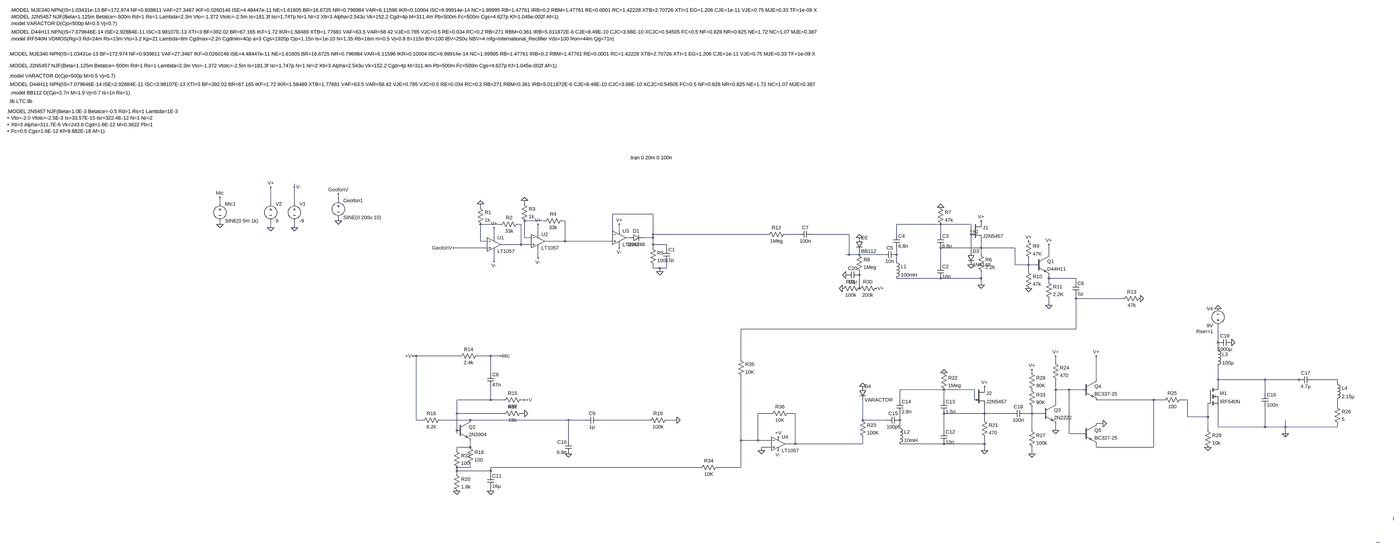
[diagram p0: schematic Final.asc, whole sheet]
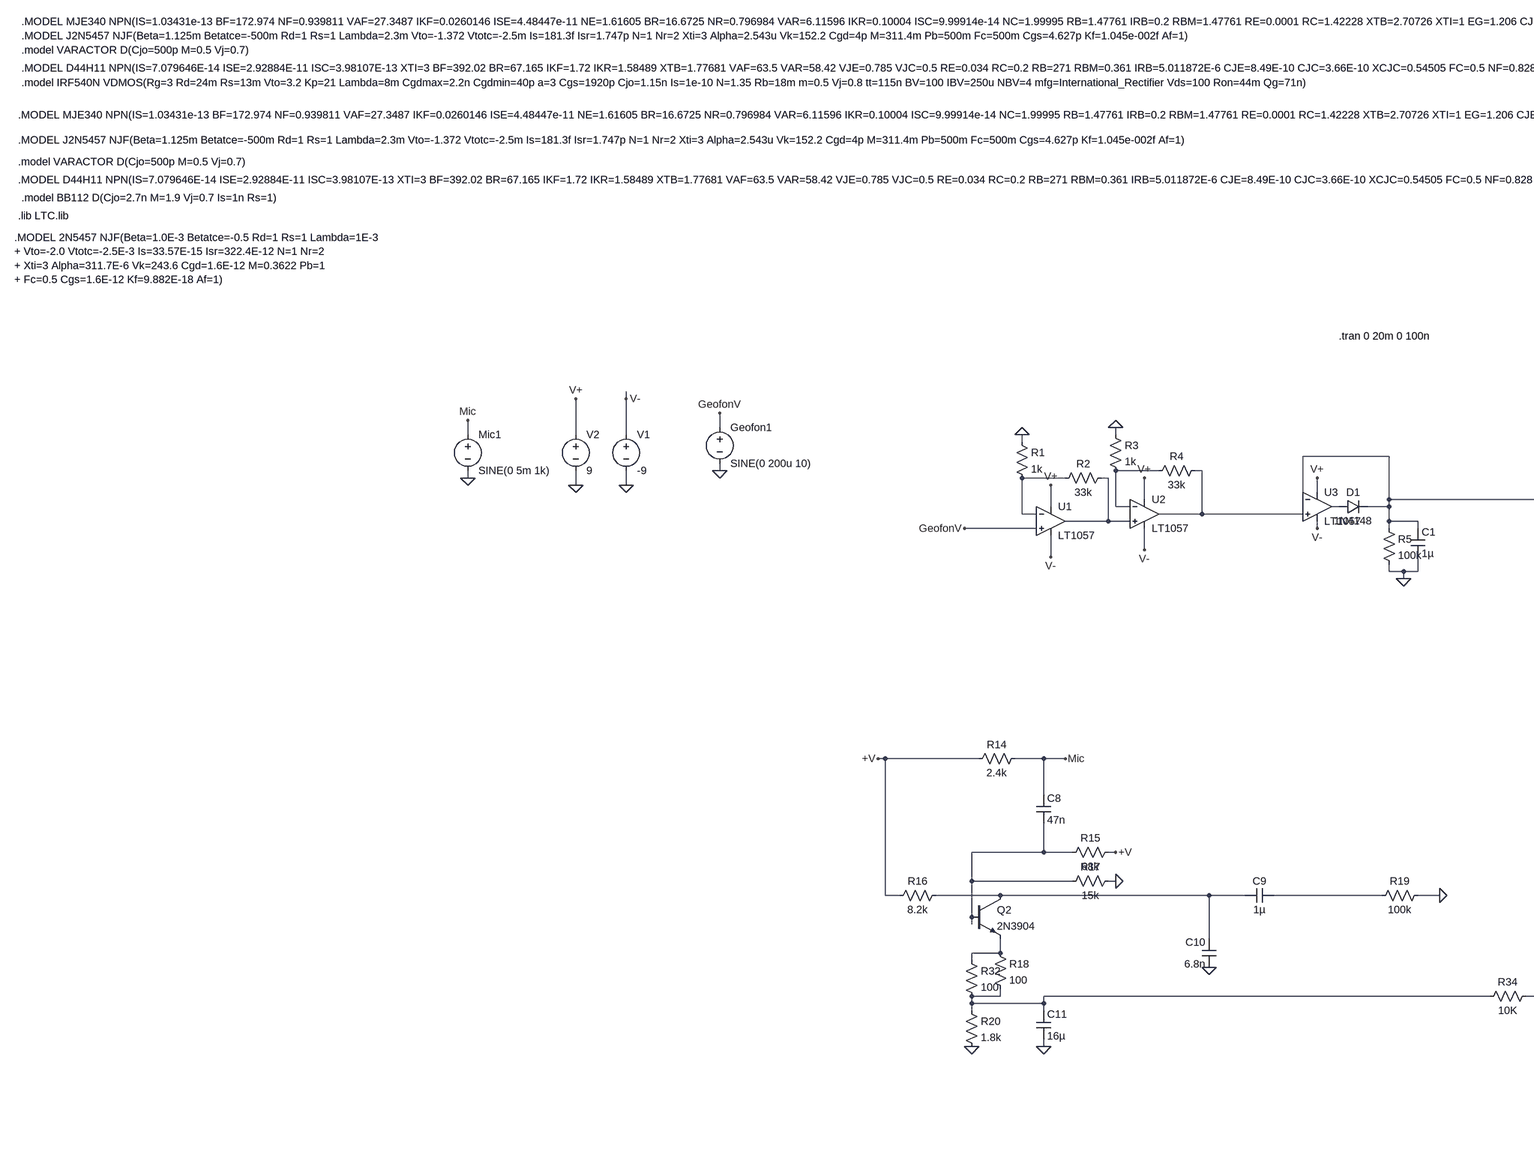
[diagram p1: schematic Final.asc, part, row 1 of 1, column 1 of 2]
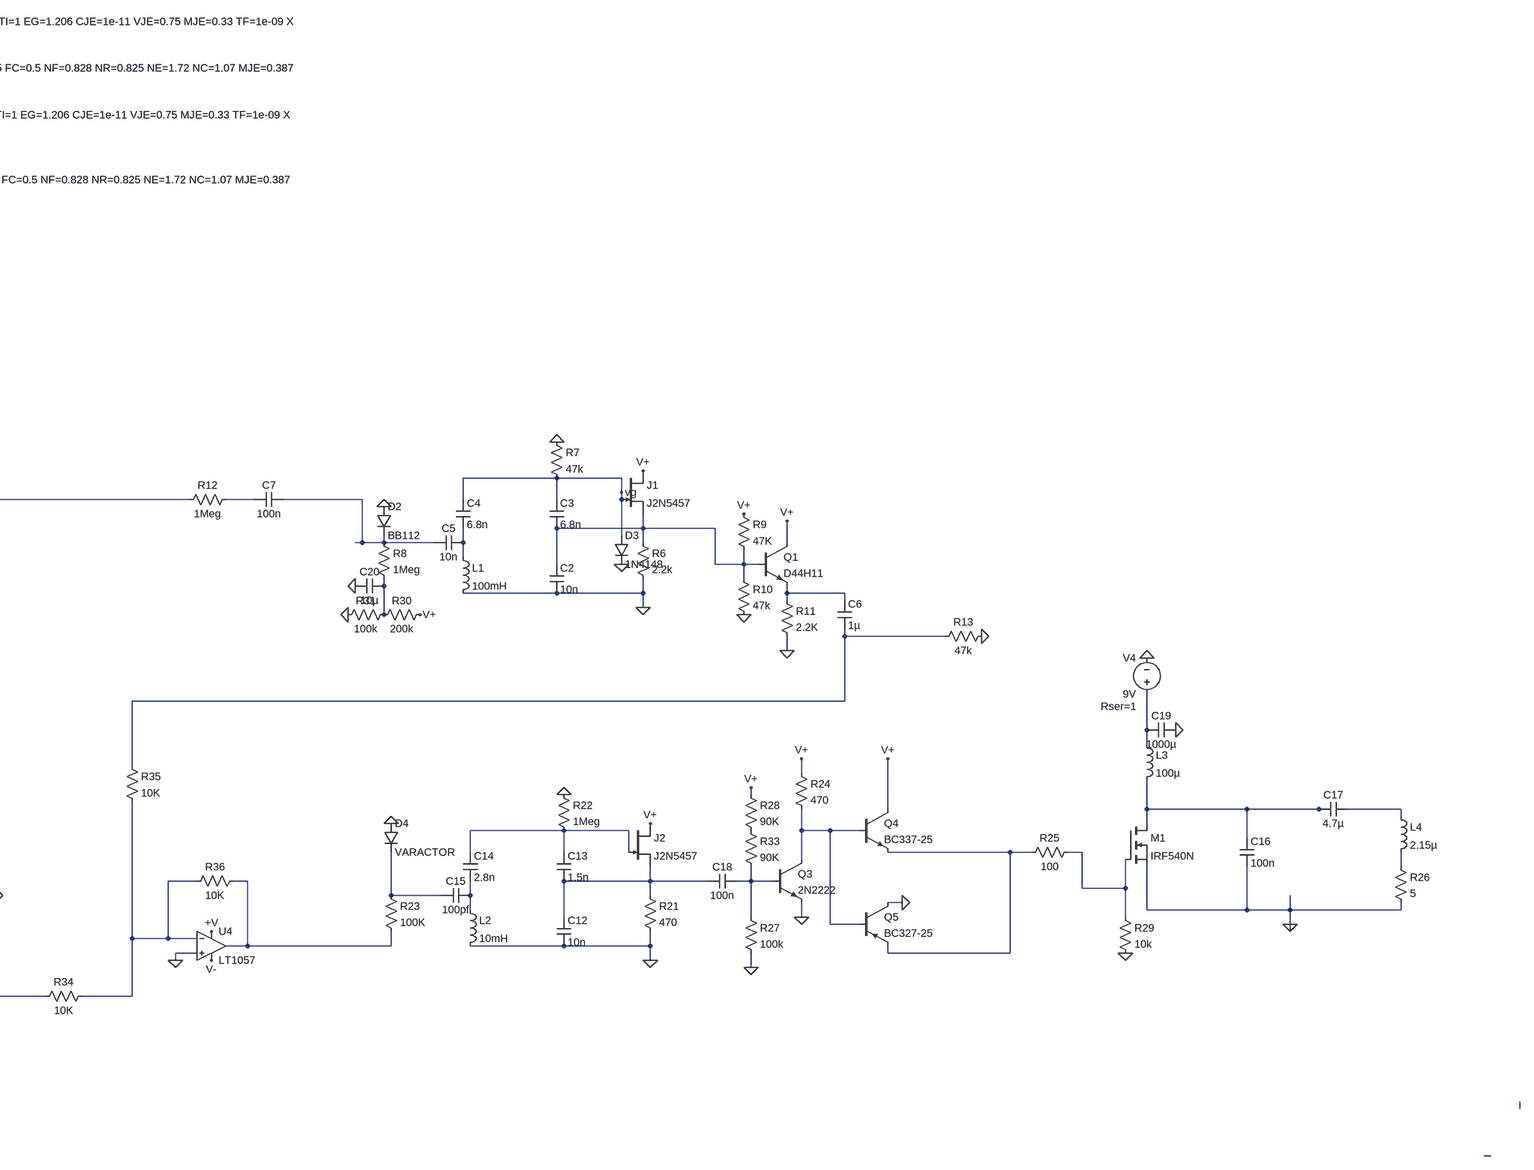
[diagram p2: schematic Final.asc, part, row 1 of 1, column 2 of 2]
Final.asc, the LTspice schematic file:
Version 4.1
SHEET 1 12308 6308
WIRE -4208 1680 -4208 1664
WIRE -4000 1744 -4000 1712
WIRE -4560 1760 -4560 1728
WIRE -4320 1760 -4320 1680
WIRE -4208 1760 -4208 1680
WIRE -3120 1760 -3120 1744
WIRE -3328 1776 -3328 1760
WIRE -2512 1808 -2704 1808
WIRE -4000 1840 -4000 1824
WIRE -3024 1840 -3120 1840
WIRE -2928 1840 -2944 1840
WIRE -4560 1856 -4560 1840
WIRE -3232 1856 -3328 1856
WIRE -3136 1856 -3152 1856
WIRE -1104 1856 -1312 1856
WIRE -960 1856 -1104 1856
WIRE -4320 1872 -4320 1840
WIRE -4208 1872 -4208 1840
WIRE -2672 1888 -2672 1856
WIRE -960 1888 -960 1856
WIRE -3056 1904 -3056 1856
WIRE -2704 1904 -2704 1808
WIRE -2512 1904 -2512 1808
WIRE -1968 1904 -2512 1904
WIRE -1824 1904 -1888 1904
WIRE -1536 1904 -1760 1904
WIRE -1312 1904 -1312 1856
WIRE -1104 1904 -1104 1856
WIRE -960 1904 -960 1888
WIRE -3264 1920 -3264 1872
WIRE -3120 1920 -3120 1840
WIRE -3088 1920 -3120 1920
WIRE -2624 1920 -2640 1920
WIRE -2512 1920 -2512 1904
WIRE -2512 1920 -2560 1920
WIRE -3328 1936 -3328 1856
WIRE -3296 1936 -3328 1936
WIRE -2928 1936 -2928 1840
WIRE -2928 1936 -3024 1936
WIRE -2704 1936 -2928 1936
WIRE -3136 1952 -3136 1856
WIRE -3136 1952 -3232 1952
WIRE -3088 1952 -3136 1952
WIRE -2512 1952 -2512 1920
WIRE -2448 1952 -2512 1952
WIRE -3296 1968 -3456 1968
WIRE -2672 1968 -2672 1952
WIRE -2512 1968 -2512 1952
WIRE -2448 1968 -2448 1952
WIRE -912 1968 -912 1936
WIRE -912 1968 -1104 1968
WIRE -752 1968 -912 1968
WIRE -960 1984 -960 1904
WIRE -1536 2000 -1536 1904
WIRE -1536 2000 -1552 2000
WIRE -1488 2000 -1488 1984
WIRE -1488 2000 -1536 2000
WIRE -1376 2000 -1488 2000
WIRE -1312 2000 -1312 1968
WIRE -912 2000 -912 1968
WIRE -592 2000 -592 1952
WIRE -3056 2016 -3056 1968
WIRE -3264 2032 -3264 1984
WIRE -1312 2032 -1312 2000
WIRE -1104 2048 -1104 1968
WIRE -960 2048 -960 2032
WIRE -752 2048 -752 1968
WIRE -688 2048 -688 2016
WIRE -688 2048 -752 2048
WIRE -656 2048 -688 2048
WIRE -2512 2064 -2512 2048
WIRE -2480 2064 -2512 2064
WIRE -2448 2064 -2448 2032
WIRE -2448 2064 -2480 2064
WIRE -2480 2080 -2480 2064
WIRE -688 2080 -688 2048
WIRE -1488 2096 -1488 2080
WIRE -1104 2112 -1312 2112
WIRE -912 2112 -912 2080
WIRE -912 2112 -1104 2112
WIRE -592 2112 -592 2096
WIRE -464 2112 -592 2112
WIRE -592 2128 -592 2112
WIRE -464 2128 -464 2112
WIRE -912 2144 -912 2112
WIRE -1488 2160 -1488 2096
WIRE -464 2208 -464 2192
WIRE -240 2208 -464 2208
WIRE -592 2240 -592 2208
WIRE -464 2352 -464 2208
WIRE -464 2352 -2096 2352
WIRE 208 2416 208 2336
WIRE 208 2448 208 2416
WIRE -3632 2480 -3648 2480
WIRE -3424 2480 -3632 2480
WIRE -3280 2480 -3344 2480
WIRE -3232 2480 -3280 2480
WIRE -2096 2496 -2096 2352
WIRE -560 2512 -560 2480
WIRE -3280 2560 -3280 2480
WIRE -672 2560 -672 2544
WIRE -368 2592 -368 2480
WIRE 208 2592 208 2528
WIRE 432 2592 208 2592
WIRE 592 2592 432 2592
WIRE 608 2592 592 2592
WIRE 816 2592 656 2592
WIRE 816 2608 816 2592
WIRE 208 2624 208 2592
WIRE -1088 2640 -1296 2640
WIRE -944 2640 -1088 2640
WIRE -560 2640 -560 2592
WIRE -496 2640 -560 2640
WIRE -432 2640 -496 2640
WIRE 432 2656 432 2592
WIRE -3280 2688 -3280 2624
WIRE -3280 2688 -3440 2688
WIRE -3216 2688 -3280 2688
WIRE -3120 2688 -3136 2688
WIRE -1296 2688 -1296 2640
WIRE -1088 2688 -1088 2640
WIRE -944 2688 -944 2640
WIRE -96 2688 -368 2688
WIRE -48 2688 -96 2688
WIRE 64 2688 32 2688
WIRE -560 2704 -560 2640
WIRE 816 2720 816 2688
WIRE -3440 2752 -3440 2688
WIRE -3216 2752 -3440 2752
WIRE -3120 2752 -3136 2752
WIRE -1952 2752 -2016 2752
WIRE -1840 2752 -1872 2752
WIRE -896 2752 -896 2720
WIRE -896 2752 -1088 2752
WIRE -768 2752 -896 2752
WIRE -672 2752 -672 2720
WIRE -672 2752 -704 2752
WIRE -624 2752 -672 2752
WIRE 64 2768 64 2688
WIRE 160 2768 160 2704
WIRE 160 2768 64 2768
WIRE -3632 2784 -3632 2480
WIRE -3600 2784 -3632 2784
WIRE -3376 2784 -3520 2784
WIRE -2912 2784 -3376 2784
WIRE -2832 2784 -2912 2784
WIRE -2528 2784 -2768 2784
WIRE -2400 2784 -2448 2784
WIRE -1472 2784 -1472 2688
WIRE -1360 2784 -1472 2784
WIRE -1296 2784 -1296 2752
WIRE -896 2784 -896 2752
WIRE -336 2800 -368 2800
WIRE -1296 2816 -1296 2784
WIRE 208 2816 208 2720
WIRE 432 2816 432 2720
WIRE 432 2816 208 2816
WIRE 528 2816 528 2784
WIRE 528 2816 432 2816
WIRE 816 2816 816 2800
WIRE 816 2816 528 2816
WIRE -3440 2832 -3440 2752
WIRE -1088 2832 -1088 2752
WIRE -672 2832 -672 2752
WIRE -560 2832 -560 2800
WIRE 160 2832 160 2768
WIRE -3440 2848 -3440 2832
WIRE -496 2848 -496 2640
WIRE -432 2848 -496 2848
WIRE 528 2848 528 2816
WIRE 528 2864 528 2848
WIRE -2912 2880 -2912 2784
WIRE -2096 2880 -2096 2576
WIRE -2016 2880 -2016 2752
WIRE -2016 2880 -2096 2880
WIRE -1952 2880 -2016 2880
WIRE -1840 2896 -1840 2752
WIRE -1840 2896 -1888 2896
WIRE -1472 2896 -1472 2864
WIRE -1472 2896 -1840 2896
WIRE -1088 2896 -1296 2896
WIRE -896 2896 -896 2864
WIRE -896 2896 -1088 2896
WIRE -3376 2912 -3376 2880
WIRE -3376 2912 -3440 2912
WIRE -1952 2912 -2000 2912
WIRE -368 2912 -368 2896
WIRE -96 2912 -96 2688
WIRE -96 2912 -368 2912
WIRE -3440 2928 -3440 2912
WIRE -2000 2928 -2000 2912
WIRE -896 2928 -896 2896
WIRE -672 2944 -672 2912
WIRE -3376 3008 -3376 2992
WIRE -3376 3008 -3440 3008
WIRE -2288 3008 -3280 3008
WIRE -2096 3008 -2096 2880
WIRE -2096 3008 -2208 3008
WIRE -3440 3024 -3440 3008
WIRE -3280 3024 -3280 3008
WIRE -3280 3024 -3440 3024
WIRE -3440 3040 -3440 3024
WIRE -3280 3040 -3280 3024
WIRE -3280 3120 -3280 3104
WIRE 2400 3360 2400 3344
WIRE 2336 3728 2320 3728
FLAG -4000 1712 GeofonV
FLAG -4000 1840 0
FLAG -4208 1872 0
FLAG -4320 1872 0
FLAG -4320 1680 V+
FLAG -4208 1680 V-
FLAG -3264 2032 V-
FLAG -3264 1872 V+
FLAG -3328 1760 0
FLAG -3456 1968 GeofonV
FLAG -3056 2016 V-
FLAG -3056 1856 V+
FLAG -3120 1744 0
FLAG -2480 2080 0
FLAG -2672 1968 V-
FLAG -2672 1856 V+
FLAG -912 2144 0
FLAG -1104 1776 0
FLAG -1488 1920 0
FLAG -688 2160 0
FLAG -592 2240 0
FLAG -960 1888 vg
FLAG -160 2208 0
FLAG -960 2048 0
FLAG -3232 2480 Mic
FLAG -4560 1856 0
FLAG -4560 1728 Mic
FLAG -2912 2944 0
FLAG -3120 2752 0
FLAG -2400 2784 0
FLAG -3440 3120 0
FLAG -3280 3120 0
FLAG -896 2928 0
FLAG -1088 2560 0
FLAG -1472 2624 0
FLAG 528 2848 0
FLAG -560 2832 0
FLAG -336 2800 0
FLAG -672 2944 0
FLAG 160 2912 0
FLAG -2000 2928 0
FLAG -3648 2480 +V
FLAG -3120 2688 +V
FLAG -1920 2864 +V
FLAG -912 1840 V+
FLAG -688 1936 V+
FLAG -592 1952 V+
FLAG -896 2624 V+
FLAG -672 2544 V+
FLAG -560 2480 V+
FLAG -368 2480 V+
FLAG 208 2256 0
FLAG 272 2416 0
FLAG -1920 2928 V-
FLAG -1568 2160 0
FLAG -1408 2160 V+
FLAG -1552 2096 0
SYMBOL voltage -4000 1728 R0
WINDOW 123 0 0 Left 0
WINDOW 39 0 0 Left 0
SYMATTR InstName Geofon1
SYMATTR Value SINE(0 200u 10)
SYMBOL OpAmps\\opamp2 -3264 1888 R0
SYMATTR InstName U1
SYMATTR Value LT1057
SYMBOL voltage -4208 1744 R0
SYMATTR InstName V1
SYMATTR Value -9
SYMBOL voltage -4320 1744 R0
SYMATTR InstName V2
SYMATTR Value 9
SYMBOL res -3344 1760 R0
SYMATTR InstName R1
SYMATTR Value 1k
SYMBOL res -3136 1840 R90
WINDOW 0 0 56 VBottom 2
WINDOW 3 32 56 VTop 2
SYMATTR InstName R2
SYMATTR Value 33k
SYMBOL OpAmps\\opamp2 -3056 1872 R0
SYMATTR InstName U2
SYMATTR Value LT1057
SYMBOL res -3136 1744 R0
SYMATTR InstName R3
SYMATTR Value 1k
SYMBOL res -2928 1824 R90
WINDOW 0 0 56 VBottom 2
WINDOW 3 32 56 VTop 2
SYMATTR InstName R4
SYMATTR Value 33k
SYMBOL res -2528 1952 R0
SYMATTR InstName R5
SYMATTR Value 100k
SYMBOL cap -2464 1968 R0
SYMATTR InstName C1
SYMATTR Value 1µ
SYMBOL OpAmps\\LT1057 -2672 1856 R0
SYMATTR InstName U3
SYMBOL diode -2624 1936 R270
WINDOW 0 32 32 VTop 2
WINDOW 3 0 32 VBottom 2
SYMATTR InstName D1
SYMATTR Value 1N4148
SYMBOL njf -960 1840 R0
SYMATTR InstName J1
SYMATTR Value J2N5457
SYMBOL res -928 1984 R0
SYMATTR InstName R6
SYMATTR Value 2.2k
SYMBOL cap -1120 2048 R0
SYMATTR InstName C2
SYMATTR Value 10n
SYMBOL cap -1120 1904 R0
SYMATTR InstName C3
SYMATTR Value 6.8n
SYMBOL cap -1328 1904 R0
SYMATTR InstName C4
SYMATTR Value 6.8n
SYMBOL ind -1328 2016 R0
SYMATTR InstName L1
SYMATTR Value 100mH
SYMATTR SpiceLine Rser=1m
SYMBOL res -1120 1760 R0
SYMATTR InstName R7
SYMATTR Value 47k
SYMBOL diode -1504 1920 R0
SYMATTR InstName D2
SYMATTR Value BB112
SYMBOL cap -1312 1984 R90
WINDOW 0 0 32 VBottom 2
WINDOW 3 32 32 VTop 2
SYMATTR InstName C5
SYMATTR Value 10n
SYMBOL res -1504 1984 R0
SYMATTR InstName R8
SYMATTR Value 1Meg
SYMBOL npn -656 2000 R0
SYMATTR InstName Q1
SYMATTR Value D44H11
SYMBOL res -704 1920 R0
SYMATTR InstName R9
SYMATTR Value 47K
SYMBOL res -704 2064 R0
SYMATTR InstName R10
SYMATTR Value 47k
SYMBOL res -608 2112 R0
SYMATTR InstName R11
SYMATTR Value 2.2K
SYMBOL cap -480 2128 R0
SYMATTR InstName C6
SYMATTR Value 1µ
SYMBOL res -1872 1888 R90
WINDOW 0 0 56 VBottom 2
WINDOW 3 32 56 VTop 2
SYMATTR InstName R12
SYMATTR Value 1Meg
SYMBOL res -144 2192 R90
WINDOW 0 0 56 VBottom 2
WINDOW 3 32 56 VTop 2
SYMATTR InstName R13
SYMATTR Value 47k
SYMBOL diode -976 1984 R0
SYMATTR InstName D3
SYMATTR Value 1N4148
SYMBOL cap -1760 1888 R90
WINDOW 0 0 32 VBottom 2
WINDOW 3 32 32 VTop 2
SYMATTR InstName C7
SYMATTR Value 100n
SYMBOL res -3328 2464 R90
WINDOW 0 0 56 VBottom 2
WINDOW 3 32 56 VTop 2
SYMATTR InstName R14
SYMATTR Value 2.4k
SYMBOL voltage -4560 1744 R0
WINDOW 123 0 0 Left 0
WINDOW 39 0 0 Left 0
SYMATTR InstName Mic1
SYMATTR Value SINE(0 5m 1k)
SYMBOL cap -3296 2560 R0
SYMATTR InstName C8
SYMATTR Value 47n
SYMBOL res -3120 2672 R90
WINDOW 0 0 56 VBottom 2
WINDOW 3 32 56 VTop 2
SYMATTR InstName R15
SYMATTR Value 68k
SYMBOL npn -3440 2784 R0
SYMATTR InstName Q2
SYMATTR Value 2N3904
SYMBOL res -3504 2768 R90
WINDOW 0 0 56 VBottom 2
WINDOW 3 32 56 VTop 2
SYMATTR InstName R16
SYMATTR Value 8.2k
SYMBOL res -3120 2736 R90
WINDOW 0 0 56 VBottom 2
WINDOW 3 32 56 VTop 2
SYMATTR InstName R17
SYMATTR Value 15k
SYMBOL cap -2768 2768 R90
WINDOW 0 0 32 VBottom 2
WINDOW 3 32 32 VTop 2
SYMATTR InstName C9
SYMATTR Value 1µ
SYMBOL cap -2896 2944 R180
WINDOW 0 24 56 Left 2
WINDOW 3 24 8 Left 2
SYMATTR InstName C10
SYMATTR Value 6.8n
SYMBOL res -3392 2896 R0
SYMATTR InstName R18
SYMATTR Value 100
SYMBOL res -2432 2768 R90
WINDOW 0 0 56 VBottom 2
WINDOW 3 32 56 VTop 2
SYMATTR InstName R19
SYMATTR Value 100k
SYMBOL res -3456 3024 R0
SYMATTR InstName R20
SYMATTR Value 1.8k
SYMBOL cap -3296 3040 R0
SYMATTR InstName C11
SYMATTR Value 16µ
SYMBOL njf -944 2624 R0
SYMATTR InstName J2
SYMATTR Value J2N5457
SYMBOL res -912 2768 R0
SYMATTR InstName R21
SYMATTR Value 470
SYMBOL cap -1104 2832 R0
SYMATTR InstName C12
SYMATTR Value 10n
SYMBOL cap -1104 2688 R0
SYMATTR InstName C13
SYMATTR Value 1.5n
SYMBOL cap -1312 2688 R0
SYMATTR InstName C14
SYMATTR Value 2.8n
SYMBOL ind -1312 2800 R0
SYMATTR InstName L2
SYMATTR Value 10mH
SYMATTR SpiceLine Rser=1m
SYMBOL res -1104 2544 R0
SYMATTR InstName R22
SYMATTR Value 1Meg
SYMBOL diode -1488 2624 R0
SYMATTR InstName D4
SYMATTR Value VARACTOR
SYMBOL cap -1296 2768 R90
WINDOW 0 0 32 VBottom 2
WINDOW 3 32 32 VTop 2
SYMATTR InstName C15
SYMATTR Value 100pf
SYMBOL res -1488 2768 R0
SYMATTR InstName R23
SYMATTR Value 100K
SYMBOL nmos 160 2624 R0
SYMATTR InstName M1
SYMATTR Value IRF540N
SYMBOL cap 416 2656 R0
SYMATTR InstName C16
SYMATTR Value 100n
SYMBOL cap 656 2576 R90
WINDOW 0 0 32 VBottom 2
WINDOW 3 32 32 VTop 2
SYMATTR InstName C17
SYMATTR Value 4.7µ
SYMBOL ind 192 2432 R0
SYMATTR InstName L3
SYMATTR Value 100µ
SYMATTR SpiceLine Rser=1m
SYMBOL npn -624 2704 R0
SYMATTR InstName Q3
SYMATTR Value 2N2222
SYMBOL npn -432 2592 R0
SYMATTR InstName Q4
SYMATTR Value BC337-25
SYMBOL pnp -432 2800 R0
SYMATTR InstName Q5
SYMATTR Value BC327-25
SYMBOL res -576 2496 R0
SYMATTR InstName R24
SYMATTR Value 470
SYMBOL res 48 2672 R90
WINDOW 0 0 56 VBottom 2
WINDOW 3 32 56 VTop 2
SYMATTR InstName R25
SYMATTR Value 100
SYMBOL ind 800 2592 R0
SYMATTR InstName L4
SYMATTR Value 2.15µ
SYMATTR SpiceLine Rser=1m
SYMBOL res 800 2704 R0
SYMATTR InstName R26
SYMATTR Value 5
SYMBOL cap -704 2736 R90
WINDOW 0 0 32 VBottom 2
WINDOW 3 32 32 VTop 2
SYMATTR InstName C18
SYMATTR Value 100n
SYMBOL res -688 2816 R0
SYMATTR InstName R27
SYMATTR Value 100k
SYMBOL res 144 2816 R0
SYMATTR InstName R29
SYMATTR Value 10k
SYMBOL OpAmps\\LT1057 -1920 2832 R0
SYMATTR InstName U4
SYMBOL res -2192 2992 R90
WINDOW 0 0 56 VBottom 2
WINDOW 3 32 56 VTop 2
SYMATTR InstName R34
SYMATTR Value 10K
SYMBOL res -1856 2736 R90
WINDOW 0 0 56 VBottom 2
WINDOW 3 32 56 VTop 2
SYMATTR InstName R36
SYMATTR Value 10K
SYMBOL res -2112 2480 R0
SYMATTR InstName R35
SYMATTR Value 10K
SYMBOL voltage 208 2352 R180
WINDOW 0 24 96 Left 2
WINDOW 3 24 16 Left 2
WINDOW 123 0 0 Left 0
WINDOW 39 24 -12 Left 2
SYMATTR InstName V4
SYMATTR Value 9V
SYMATTR SpiceLine Rser=1
SYMBOL cap 272 2400 R90
WINDOW 0 0 32 VBottom 2
WINDOW 3 32 32 VTop 2
SYMATTR InstName C19
SYMATTR Value 1000µ
SYMBOL res -1392 2144 R90
WINDOW 0 0 56 VBottom 2
WINDOW 3 32 56 VTop 2
SYMATTR InstName R30
SYMATTR Value 200k
SYMBOL res -1472 2144 R90
WINDOW 0 0 56 VBottom 2
WINDOW 3 32 56 VTop 2
SYMATTR InstName R31
SYMATTR Value 100k
SYMBOL cap -1488 2080 R90
WINDOW 0 0 32 VBottom 2
WINDOW 3 32 32 VTop 2
SYMATTR InstName C20
SYMATTR Value 10µ
SYMBOL res -3456 2912 R0
SYMATTR InstName R32
SYMATTR Value 100
SYMBOL res -688 2544 R0
SYMATTR InstName R28
SYMATTR Value 90K
SYMBOL res -688 2624 R0
SYMATTR InstName R33
SYMATTR Value 90K
TEXT -5560 408 Left 2 !.lib LTC.lib
TEXT -5552 368 Left 2 !.model BB112 D(Cjo=2.7n M=1.9 Vj=0.7 Is=1n Rs=1)
TEXT -5560 240 Left 2 !.MODEL J2N5457 NJF(Beta=1.125m Betatce=-500m Rd=1 Rs=1 Lambda=2.3m Vto=-1.372 Vtotc=-2.5m Is=181.3f Isr=1.747p N=1 Nr=2 Xti=3 Alpha=2.543u Vk=152.2 Cgd=4p M=311.4m Pb=500m Fc=500m Cgs=4.627p Kf=1.045e-002f Af=1)
TEXT -5560 288 Left 2 !.model VARACTOR D(Cjo=500p M=0.5 Vj=0.7)
TEXT -5560 328 Left 2 !.MODEL D44H11 NPN(IS=7.079646E-14 ISE=2.92884E-11 ISC=3.98107E-13 XTI=3 BF=392.02 BR=67.165 IKF=1.72 IKR=1.58489 XTB=1.77681 VAF=63.5 VAR=58.42 VJE=0.785 VJC=0.5 RE=0.034 RC=0.2 RB=271 RBM=0.361 IRB=5.011872E-6 CJE=8.49E-10 CJC=3.66E-10 XCJC=0.54505 FC=0.5 NF=0.828 NR=0.825 NE=1.72 NC=1.07 MJE=0.387 MJC=0.352 EG=0.958 VCEO=80 ICRATING=10 MFG=FAIRCHILD)
TEXT -5560 184 Left 2 !.MODEL MJE340 NPN(IS=1.03431e-13 BF=172.974 NF=0.939811 VAF=27.3487 IKF=0.0260146 ISE=4.48447e-11 NE=1.61605 BR=16.6725 NR=0.796984 VAR=6.11596 IKR=0.10004 ISC=9.99914e-14 NC=1.99995 RB=1.47761 IRB=0.2 RBM=1.47761 RE=0.0001 RC=1.42228 XTB=2.70726 XTI=1 EG=1.206 CJE=1e-11 VJE=0.75 MJE=0.33 TF=1e-09 XTF=1 VTF=10 ITF=0.01 CJC=1e-11 VJC=0.75 MJC=0.33 XCJC=0.9 FC=0.5 CJS=0 VJS=0.75 MJS=0.5 TR=1e-07 PTF=0 Vceo=300 Icrating=0.5A mfg=OnSemi)
TEXT -5568 456 Left 2 !.MODEL 2N5457 NJF(Beta=1.0E-3 Betatce=-0.5 Rd=1 Rs=1 Lambda=1E-3\n+ Vto=-2.0 Vtotc=-2.5E-3 Is=33.57E-15 Isr=322.4E-12 N=1 Nr=2\n+ Xti=3 Alpha=311.7E-6 Vk=243.6 Cgd=1.6E-12 M=0.3622 Pb=1\n+ Fc=0.5 Cgs=1.6E-12 Kf=9.882E-18 Af=1)
TEXT -5552 8 Left 2 !.MODEL J2N5457 NJF(Beta=1.125m Betatce=-500m Rd=1 Rs=1 Lambda=2.3m Vto=-1.372 Vtotc=-2.5m Is=181.3f Isr=1.747p N=1 Nr=2 Xti=3 Alpha=2.543u Vk=152.2 Cgd=4p M=311.4m Pb=500m Fc=500m Cgs=4.627p Kf=1.045e-002f Af=1)
TEXT -5552 40 Left 2 !.model VARACTOR D(Cjo=500p M=0.5 Vj=0.7)
TEXT -5552 80 Left 2 !.MODEL D44H11 NPN(IS=7.079646E-14 ISE=2.92884E-11 ISC=3.98107E-13 XTI=3 BF=392.02 BR=67.165 IKF=1.72 IKR=1.58489 XTB=1.77681 VAF=63.5 VAR=58.42 VJE=0.785 VJC=0.5 RE=0.034 RC=0.2 RB=271 RBM=0.361 IRB=5.011872E-6 CJE=8.49E-10 CJC=3.66E-10 XCJC=0.54505 FC=0.5 NF=0.828 NR=0.825 NE=1.72 NC=1.07 MJE=0.387 MJC=0.352 EG=0.958 VCEO=80 ICRATING=10 MFG=FAIRCHILD)
TEXT -5552 -24 Left 2 !.MODEL MJE340 NPN(IS=1.03431e-13 BF=172.974 NF=0.939811 VAF=27.3487 IKF=0.0260146 ISE=4.48447e-11 NE=1.61605 BR=16.6725 NR=0.796984 VAR=6.11596 IKR=0.10004 ISC=9.99914e-14 NC=1.99995 RB=1.47761 IRB=0.2 RBM=1.47761 RE=0.0001 RC=1.42228 XTB=2.70726 XTI=1 EG=1.206 CJE=1e-11 VJE=0.75 MJE=0.33 TF=1e-09 XTF=1 VTF=10 ITF=0.01 CJC=1e-11 VJC=0.75 MJC=0.33 XCJC=0.9 FC=0.5 CJS=0 VJS=0.75 MJS=0.5 TR=1e-07 PTF=0 Vceo=300 Icrating=0.5A mfg=OnSemi)
TEXT -5552 112 Left 2 !.model IRF540N VDMOS(Rg=3 Rd=24m Rs=13m Vto=3.2 Kp=21 Lambda=8m Cgdmax=2.2n Cgdmin=40p a=3 Cgs=1920p Cjo=1.15n Is=1e-10 N=1.35 Rb=18m m=0.5 Vj=0.8 tt=115n BV=100 IBV=250u NBV=4 mfg=International_Rectifier Vds=100 Ron=44m Qg=71n)
TEXT -2624 1512 Left 2 !.tran 0 20m 0 100n

The netlist it stands for:
* Final.asc
V§Geofon1 GeofonV 0 SINE(0 200u 10)
X§U1 GeofonV N004 V+ V- N005 LT1057  ; pins In+ In- V+ V- OUT
V1 V- 0 -9
V2 V+ 0 9
R1 0 N004 1k
R2 N005 N004 33k
X§U2 N005 N002 V+ V- N003 LT1057  ; pins In+ In- V+ V- OUT
R3 0 N002 1k
R4 N003 N002 33k
R5 N001 0 100k
C1 N001 0 1µ
X§U3 N003 N001 V+ V- N008 LT1057  ; pins In+ In- V+ V- OUT
D1 N008 N001 1N4148
J1 V+ vg N009 J2N5457
R6 N009 0 2.2k
C2 N009 0 10n
C3 vg N009 6.8n
C4 vg N010 6.8n
L1 N010 0 100mH Rser=1m
R7 0 vg 47k
D2 0 N007 BB112
C5 N010 N007 10n
R8 N007 N011 1Meg
Q1 V+ N009 N012 0 D44H11
R9 V+ N009 47K
R10 N009 0 47k
R11 N012 0 2.2K
C6 N012 N013 1µ
R12 N006 N001 1Meg
R13 0 N013 47k
D3 vg 0 1N4148
C7 N007 N006 100n
R14 Mic +V 2.4k
V§Mic1 Mic 0 SINE(0 5m 1k)
C8 Mic N019 47n
R15 +V N019 68k
Q2 N027 N019 N031 0 2N3904
R16 N027 +V 8.2k
R17 0 N019 15k
C9 N028 N027 1µ
C10 0 N027 6.8n
R18 N031 N032 100
R19 0 N028 100k
R20 N032 0 1.8k
C11 N032 0 16µ
J2 V+ N017 N025 J2N5457
R21 N025 0 470
C12 N025 0 10n
C13 N017 N025 1.5n
C14 N017 N030 2.8n
L2 N030 0 10mH Rser=1m
R22 0 N017 1Meg
D4 0 N029 VARACTOR
C15 N030 N029 100pf
R23 N029 N024 100K
M1 N015 N021 0 0 IRF540N
C16 N015 0 100n
C17 N016 N015 4.7µ
L3 N014 N015 100µ Rser=1m
Q3 N018 N026 0 0 2N2222
Q4 V+ N018 N020 0 BC337-25
Q5 0 N018 N020 0 BC327-25
R24 V+ N018 470
R25 N021 N020 100
L4 N016 N022 2.15µ Rser=1m
R26 N022 0 5
C18 N026 N025 100n
R27 N026 0 100k
R29 N021 0 10k
X§U4 0 N023 +V V- N024 LT1057  ; pins In+ In- V+ V- OUT
R34 N023 N032 10K
R36 N024 N023 10K
R35 N013 N023 10K
V4 N014 0 9V Rser=1
C19 0 N014 1000µ
R30 V+ N011 200k
R31 N011 0 100k
C20 N011 0 10µ
R32 N031 N032 100
R28 V+ P001 90K
R33 P001 N026 90K
.model D D
.lib standard.dio
.model NPN NPN
.model PNP PNP
.lib standard.bjt
.model NJF NJF
.model PJF PJF
.lib standard.jft
.model NMOS NMOS
.model PMOS PMOS
.lib standard.mos
.lib LTC.lib
.model BB112 D(Cjo=2.7n M=1.9 Vj=0.7 Is=1n Rs=1)
.MODEL J2N5457 NJF(Beta=1.125m Betatce=-500m Rd=1 Rs=1 Lambda=2.3m Vto=-1.372 Vtotc=-2.5m Is=181.3f Isr=1.747p N=1 Nr=2 Xti=3 Alpha=2.543u Vk=152.2 Cgd=4p M=311.4m Pb=500m Fc=500m Cgs=4.627p Kf=1.045e-002f Af=1)
.model VARACTOR D(Cjo=500p M=0.5 Vj=0.7)
.MODEL D44H11 NPN(IS=7.079646E-14 ISE=2.92884E-11 ISC=3.98107E-13 XTI=3 BF=392.02 BR=67.165 IKF=1.72 IKR=1.58489 XTB=1.77681 VAF=63.5 VAR=58.42 VJE=0.785 VJC=0.5 RE=0.034 RC=0.2 RB=271 RBM=0.361 IRB=5.011872E-6 CJE=8.49E-10 CJC=3.66E-10 XCJC=0.54505 FC=0.5 NF=0.828 NR=0.825 NE=1.72 NC=1.07 MJE=0.387 MJC=0.352 EG=0.958 VCEO=80 ICRATING=10 MFG=FAIRCHILD)
.MODEL MJE340 NPN(IS=1.03431e-13 BF=172.974 NF=0.939811 VAF=27.3487 IKF=0.0260146 ISE=4.48447e-11 NE=1.61605 BR=16.6725 NR=0.796984 VAR=6.11596 IKR=0.10004 ISC=9.99914e-14 NC=1.99995 RB=1.47761 IRB=0.2 RBM=1.47761 RE=0.0001 RC=1.42228 XTB=2.70726 XTI=1 EG=1.206 CJE=1e-11 VJE=0.75 MJE=0.33 TF=1e-09 XTF=1 VTF=10 ITF=0.01 CJC=1e-11 VJC=0.75 MJC=0.33 XCJC=0.9 FC=0.5 CJS=0 VJS=0.75 MJS=0.5 TR=1e-07 PTF=0 Vceo=300 Icrating=0.5A mfg=OnSemi)
.MODEL 2N5457 NJF(Beta=1.0E-3 Betatce=-0.5 Rd=1 Rs=1 Lambda=1E-3
+ Vto=-2.0 Vtotc=-2.5E-3 Is=33.57E-15 Isr=322.4E-12 N=1 Nr=2
+ Xti=3 Alpha=311.7E-6 Vk=243.6 Cgd=1.6E-12 M=0.3622 Pb=1
+ Fc=0.5 Cgs=1.6E-12 Kf=9.882E-18 Af=1)
.MODEL J2N5457 NJF(Beta=1.125m Betatce=-500m Rd=1 Rs=1 Lambda=2.3m Vto=-1.372 Vtotc=-2.5m Is=181.3f Isr=1.747p N=1 Nr=2 Xti=3 Alpha=2.543u Vk=152.2 Cgd=4p M=311.4m Pb=500m Fc=500m Cgs=4.627p Kf=1.045e-002f Af=1)
.model VARACTOR D(Cjo=500p M=0.5 Vj=0.7)
.MODEL D44H11 NPN(IS=7.079646E-14 ISE=2.92884E-11 ISC=3.98107E-13 XTI=3 BF=392.02 BR=67.165 IKF=1.72 IKR=1.58489 XTB=1.77681 VAF=63.5 VAR=58.42 VJE=0.785 VJC=0.5 RE=0.034 RC=0.2 RB=271 RBM=0.361 IRB=5.011872E-6 CJE=8.49E-10 CJC=3.66E-10 XCJC=0.54505 FC=0.5 NF=0.828 NR=0.825 NE=1.72 NC=1.07 MJE=0.387 MJC=0.352 EG=0.958 VCEO=80 ICRATING=10 MFG=FAIRCHILD)
.MODEL MJE340 NPN(IS=1.03431e-13 BF=172.974 NF=0.939811 VAF=27.3487 IKF=0.0260146 ISE=4.48447e-11 NE=1.61605 BR=16.6725 NR=0.796984 VAR=6.11596 IKR=0.10004 ISC=9.99914e-14 NC=1.99995 RB=1.47761 IRB=0.2 RBM=1.47761 RE=0.0001 RC=1.42228 XTB=2.70726 XTI=1 EG=1.206 CJE=1e-11 VJE=0.75 MJE=0.33 TF=1e-09 XTF=1 VTF=10 ITF=0.01 CJC=1e-11 VJC=0.75 MJC=0.33 XCJC=0.9 FC=0.5 CJS=0 VJS=0.75 MJS=0.5 TR=1e-07 PTF=0 Vceo=300 Icrating=0.5A mfg=OnSemi)
.model IRF540N VDMOS(Rg=3 Rd=24m Rs=13m Vto=3.2 Kp=21 Lambda=8m Cgdmax=2.2n Cgdmin=40p a=3 Cgs=1920p Cjo=1.15n Is=1e-10 N=1.35 Rb=18m m=0.5 Vj=0.8 tt=115n BV=100 IBV=250u NBV=4 mfg=International_Rectifier Vds=100 Ron=44m Qg=71n)
.tran 0 20m 0 100n
.lib LTC.lib
.backanno
.end